# Altium project Board_4.PrjPcb
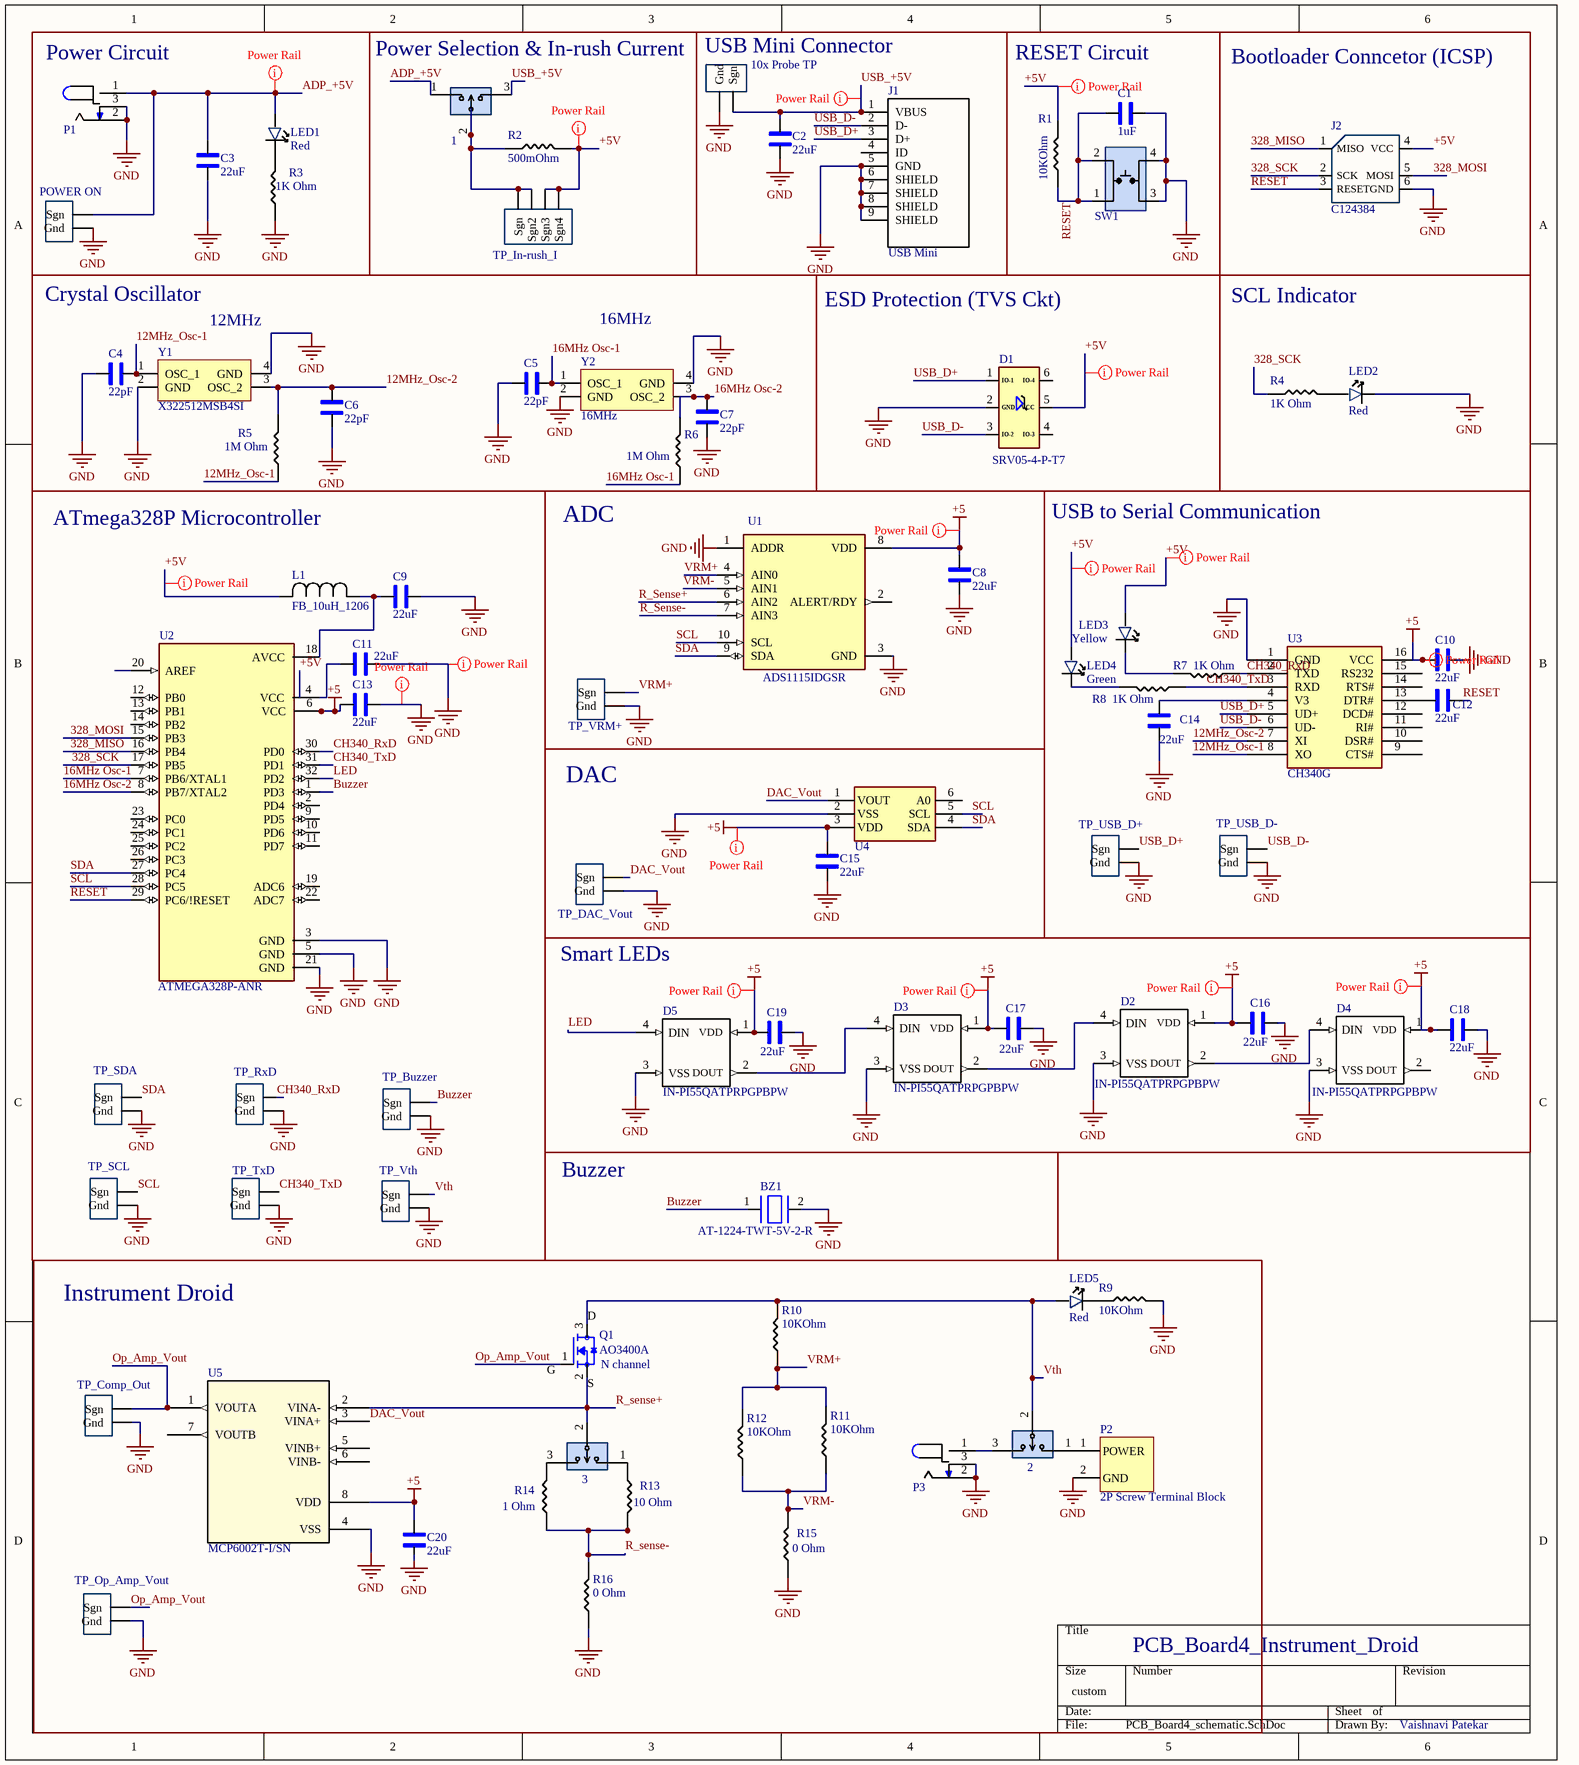
[diagram p0: PCB_Board4_schematic.SchDoc]
1 sheet, 80 parts. Net scope: global (net labels, ports and power ports of the same name join across sheets).
Board file: PCB_Board_4_Layout.PcbDoc

## Sheet PCB_Board4_schematic.SchDoc
size 292 x 330 mm; SheetNumber: 1; SheetTotal: 1

### Parts
1  PREC003SAAN-RC  [3_PIN_100mil]  (value not drawn)
2  PREC003SAAN-RC  [3_PIN_100mil]  (value not drawn)
3  PREC003SAAN-RC  [3_PIN_100mil]  (value not drawn)
BZ1  AT-1224-TWT-5V-2-R  [BUZZER- TH]
C1  1uF  [1206_Passive_Capacitor]
C2  22uF  [1206_Passive_Capacitor]
C3  22uF  [1206_Passive_Capacitor]
C4  22pF  [1206_Passive_Capacitor]
C5  22pF  [1206_Passive_Capacitor]
C6  22pF  [1206_Passive_Capacitor]
C7  22pF  [1206_Passive_Capacitor]
C8  22uF  [1206_Passive_Capacitor]
C9  22uF  [1206_Passive_Capacitor]
C10  22uF  [1206_Passive_Capacitor]
C11  22uF  [1206_Passive_Capacitor]
C12  22uF  [1206_Passive_Capacitor]
C13  22uF  [1206_Passive_Capacitor]
C14  22uF  [1206_Passive_Capacitor]
C15  22uF  [1206_Passive_Capacitor]
C16  22uF  [1206_Passive_Capacitor]
C17  22uF  [1206_Passive_Capacitor]
C18  22uF  [1206_Passive_Capacitor]
C19  22uF  [1206_Passive_Capacitor]
C20  22uF  [1206_Passive_Capacitor]
D1  SRV05-4-P-T7  [TVS]
D2  IN-PI55QATPRPGPBPW  [SERIAL_LED - duplicate]
D3  IN-PI55QATPRPGPBPW  [SERIAL_LED - duplicate]
D4  IN-PI55QATPRPGPBPW  [SERIAL_LED - duplicate]
D5  IN-PI55QATPRPGPBPW  [SERIAL_LED - duplicate]
J1  USB Mini  [USB_MINI_B]
J2  LCSC Part#: C124384  [ICSP]  (hidden comment: NRPN032PAEN-RC)
L1  FB_10uH_1206  [AIML-1206_ABR-M]
LED1  Red  [LED_1206]
LED2  Red  [LED_1206]
LED3  Yellow  [LED_1206]
LED4  Green  [LED_1206]
LED5  Red  [LED_1206]
P1  Power Jack  [Power_Jack]  (value not drawn)
P2  2P Screw Terminal Block  [P_Terminal block 3.5mm-pitch]
P3  Power Jack  [Power_Jack]  (value not drawn)
POWER_ON  10x Probe TP  [TP10x_Probe]  (value not drawn)
Q1  AO3400A  value N channel  [N-MOSFET]
R1  value 10KOhm  [1206_Passive_Resitor]  (hidden comment: 10k)
R2  value 500mOhm  [1206_Passive_Resitor]  (hidden comment: 500m)
R3  value 1K Ohm  [1206_Passive_Resitor]  (hidden comment: 1k)
R4  value 1K Ohm  [1206_Passive_Resitor]  (hidden comment: 1k)
R5  value 1M Ohm  [1206_Passive_Resitor]  (hidden comment: 1M)
R6  value 1M Ohm  [1206_Passive_Resitor]  (hidden comment: 1M)
R7  value 1K Ohm  [1206_Passive_Resitor]  (hidden comment: 1k)
R8  value 1K Ohm  [1206_Passive_Resitor]  (hidden comment: 1k)
R9  value 10KOhm  [1206_Passive_Resitor]  (hidden comment: 10k)
R10  value 10KOhm  [1206_Passive_Resitor]  (hidden comment: 10k)
R11  value 10KOhm  [1206_Passive_Resitor]  (hidden comment: 10k)
R12  value 10KOhm  [1206_Passive_Resitor]  (hidden comment: 10k)
R13  10 Ohm  [1206_Passive_Resitor]
R14  1 Ohm  [1206_Passive_Resitor]
R15  0 Ohm  [1206_Passive_Resitor]
R16  0 Ohm  [1206_Passive_Resitor]
SW1  TL3305AF160QG  [Switch_JLC]  (value not drawn)
TP1  10x Probe TP  [TP10x_Probe]
TP4  TP_VRM+  [TP10x_Probe]
TP5  TP_USB_D+  [TP10x_Probe]
TP6  TP_USB_D-  [TP10x_Probe]
TP7  TP_DAC_Vout  [TP10x_Probe]
TP8  TP_SDA  [TP10x_Probe]
TP9  TP_RxD  [TP10x_Probe]
TP10  TP_Buzzer  [TP10x_Probe]
TP11  TP_SCL  [TP10x_Probe]
TP12  TP_TxD  [TP10x_Probe]
TP13  TP_Vth  [TP10x_Probe]
TP14  TP_Comp_Out  [TP10x_Probe]
TP15  TP_Op_Amp_Vout  [TP10x_Probe]
TP_In-rush_I  TP_In-rush_current  [TP10x_Floating]  (value not drawn)
U1  ADS1115IDGSR  [ADC_ADS1115IDGSR]
U2  ATMEGA328P-ANR  [ATMega328P]
U3  CH340G  [USB to serial]
U4  DAC IC  [MCP4725]  (value not drawn)
U5  MCP6002T-I/SN  [SOIC127P600X175-8N]
Y1  X322512MSB4SI  [Crystal resonator]
Y2  value 16MHz  [Crystal resonator]  (hidden comment: X322516MLB4SI)

### Blocks framed on the sheet
Power Circuit: C3 LED1 P1 POWER_ON R3
Power Selection & In-rush Current: 1 R2 TP_In-rush_I
USB Mini Connector: C2 J1 TP1
RESET Circuit: C1 R1 SW1
Bootloader Conncetor (ICSP): J2
Crystal Oscillator: C4-C7 R5 R6 Y1 Y2
ESD Protection (TVS Ckt): D1
SCL Indicator: LED2 R4
ATmega328P Microcontroller: C9 C11 C13 L1 TP8-TP13 U2
ADC: C8 TP4 U1
USB to Serial Communication: C10 C12 C14 LED3 LED4 R7 R8 TP5 TP6 U3
DAC: C15 TP7 U4
Smart LEDs: C16-C19 D2-D5
Buzzer: BZ1
Instrument Droid: 2 3 C20 LED5 P2 P3 Q1 R9-R16 TP14 TP15 U5

### Nets
+5: C8.1 C10.2 C13.2 C15.1 C16.2 C17.2 C18.1 C19.2 C20.1 D2.1(VDD) D3.1(VDD) D4.1(VDD) D5.1(VDD) U1.8(VDD) U2.6(VCC) U3.16(VCC) U4.3(VDD) U5.8(VDD)
GND: BZ1.2(BZ2) C1.2 C2.1 C3.1 C4.1 C5.1 C6.1 C7.1 C8.2 C9.1 C10.1 C11.1 C13.1 C14.2 C15.2 C16.1 C17.1 C18.2 C19.1 C20.2 D1.2(GND) D2.3(VSS) D3.3(VSS) D4.3(VSS) D5.3(VSS) J1.5(GND) J1.6(SHIELD) J1.7(SHIELD) J1.8(SHIELD) J1.9(SHIELD) J2.6(GND) LED2.2 P1.2 P1.3 P2.2(GND) P3.2 P3.3 POWER_ON.2(Gnd) R3.1 R9.2 R15.1 R16.1 SW1.3 SW1.4 TP1.2(Gnd) TP4.2(Gnd) TP5.2(Gnd) TP6.2(Gnd) TP7.2(Gnd) TP8.2(Gnd) TP9.2(Gnd) TP10.2(Gnd) TP11.2(Gnd) TP12.2(Gnd) TP13.2(Gnd) TP14.2(Gnd) TP15.2(Gnd) U1.1(ADDR) U1.3(GND) U2.3(GND) U2.5(GND) U2.21(GND) U3.1(GND) U4.2(VSS) U5.4(VSS) Y1.2(GND) Y1.4(GND) Y2.2(GND) Y2.4(GND)
12MHz_Osc-1: C4.2 R5.1 U3.8(XO) Y1.1(OSC_1)
12MHz_Osc-2: C6.2 R5.2 U3.7(XI) Y1.3(OSC_2)
16MHz Osc-1: C5.2 R6.1 U2.7(PB6/XTAL1) Y2.1(OSC_1)
16MHz Osc-2: C7.2 R6.2 U2.8(PB7/XTAL2) Y2.3(OSC_2)
328_MISO: J2.1(MISO) U2.16(PB4)
328_MOSI: J2.5(MOSI) U2.15(PB3)
328_SCK: J2.2(SCK) R4.1 U2.17(PB5)
+5V: D1.5(VCC) J2.4(VCC) L1.2 LED3.1 LED4.1 R1.2 R2.2 TP_In-rush_I.3(Sgn3) TP_In-rush_I.4(Sgn4)
ADP_+5V: 1.1 C3.2 LED1.1 P1.1 POWER_ON.1(Sgn)
Buzzer: BZ1.1(BZ1) TP10.1(Sgn) U2.1(PD3)
CH340_RxD: R7.1 TP9.1(Sgn) U2.30(PD0) U3.2(TXD)
CH340_TxD: R8.1 TP12.1(Sgn) U2.31(PD1) U3.3(RXD)
DAC_Vout: TP7.1(Sgn) U4.1(VOUT) U5.3(VINA+)
LED: D5.4(DIN) U2.32(PD2)
Op_Amp_Vout: Q1.1(G) TP14.1(Sgn) TP15.1(Sgn) U5.1(VOUTA)
R_Sense+: 3.2 Q1.2(S) U1.6(AIN2) U5.2(VINA-)
R_Sense-: R13.2 R14.1 R16.2 U1.7(AIN3)
RESET: C1.1 C12.1 J2.3(RESET) R1.1 SW1.1 SW1.2 U2.29(PC6/!RESET)
SCL: TP11.1(Sgn) U1.10(SCL) U2.28(PC5) U4.5(SCL)
SDA: TP8.1(Sgn) U1.9(SDA) U2.27(PC4) U4.4(SDA)
USB_+5V: 1.3 C2.2 J1.1(VBUS) TP1.1(Sgn)
USB_D+: D1.1(IO-1) J1.3(D+) TP5.1(Sgn) U3.5(UD+)
USB_D-: D1.3(IO-2) J1.2(D-) TP6.1(Sgn) U3.6(UD-)
VRM+: R10.1 R11.2 R12.2 TP4.1(Sgn) U1.4(AIN0)
VRM-: R11.1 R12.1 R15.2 U1.5(AIN1)
Vth: 2.2 LED5.1 Q1.3(D) R10.2 TP13.1(Sgn)
Net1_2: 1.2 R2.1 TP_In-rush_I.1(Sgn) TP_In-rush_I.2(Sgn2)
Net2_1: 2.1 P2.1(POWER)
Net2_3: 2.3 P3.1
Net3_1: 3.1 R13.1
Net3_3: 3.3 R14.2
NetC9_2: C9.2 L1.1 U2.18(AVCC)
NetC11_2: C11.2 U2.4(VCC)
NetC12_2: C12.2 U3.13(DTR#)
NetC14_1: C14.1 U3.4(V3)
NetD2_2: D2.2(DOUT) D4.4(DIN)
NetD2_4: D2.4(DIN) D3.2(DOUT)
NetD3_4: D3.4(DIN) D5.2(DOUT)
NetLED1_2: LED1.2 R3.2
NetLED2_1: LED2.1 R4.2
NetLED3_2: LED3.2 R7.2
NetLED4_2: LED4.2 R8.2
NetLED5_2: LED5.2 R9.1

Not connected (* = marked no-connect by the designer): D1 4(IO-3) 6(IO-4); D4 2(DOUT); J1 4(ID); U1 2(ALERT/RDY); U2 2(PD4) 9(PD5) 10(PD6) 11(PD7) 12(PB0) 13(PB1) 14(PB2) 19(ADC6) 20(AREF) 22(ADC7) 23(PC0) 24(PC1) 25(PC2) 26(PC3); U3 9(CTS#) 10(DSR#) 11(RI#) 12(DCD#) 14(RTS#) 15(RS232); U4 6(A0); U5 5(VINB+) 6(VINB-) 7(VOUTB)

### Layout directives
mark named Power Rail: +5V
rule Width Constraint [Pref Width = 20mil    Min Width = 20mil    Max Width = 100mil]: +5, +5V, ADP_+5V, GND, USB_+5V

### Notes on the sheet
- (near Y1) 12MHz
- 16MHz
- PCB_Board4_Instrument_Droid
- Vaishnavi Patekar

### Library data of the parts
1-3 = SW_3Pin_100mil_Switch: Connector Header Through Hole 3 position 0.100" (2.54mm); Value: CONN HEADER VERT 3POS 2.54MM; Digikey Link: https://www.digikey.com/product-detail/en/PREC003SAAN-RC/S1012EC-03-ND/2774851/?itemSeq=304982371; MFR Part #: PREC003SAAN-RC; Type: Extended; LCSC Part#: C49257
BZ1 = BUZZER_1: Buzzers Transducer, Externally Driven Electromechanical/Magnetic 5 V 40mA 2.4kHz 87dB @ 5V, 10cm Through Hole PC Pins; Datasheet: https://www.puiaudio.com/media/SpecSheet/AT-1224-TWT-5V-2-R.pdf; MFR Part #: AT-1224-TWT-5V-2-R
C1 = C_1uF_1206: MULTILAYER CERAMIC CAPACITORS MLCC - SMD/SMT 1UF 50V 1206 ROHS; MFR Part #: CL31B105KBHNNNE; Type: Basic; Digikey Link: https://www.digikey.com/product-detail/en/C1206C105M4RACTU/399-8150-1-ND/3471873/?itemSeq=304982366; LCSC Part#: C1848; Value: 1uF
C2 C3 C8-C20 = C_22uF_1206: 22uF ±10% 25V X5R 1206 Multilayer Ceramic Capacitors MLCC - SMD/SMT RoHS; MFR Part #: CL31A226KAHNNNE; Type: basic; LCSC Part#: C12891; Datasheet: https://datasheet.lcsc.com/lcsc/1811031514_Samsung-Electro-Mechanics-CL31A226KAHNNNE_C12891.pdf; Value: 22uF
C4-C7 = C_22pF_1206: 22pF ±5% 1kV C0G 1206 Multilayer Ceramic Capacitors MLCC - SMD/SMT RoHS; MFR Part #: 1206CG220J102NT; Type: Extended; LCSC Part#: C313096; Datasheet: https://datasheet.lcsc.com/lcsc/1810311150_FH-Guangdong-Fenghua-Advanced-Tech-1206CG220J102NT_C313096.pdf; Value: 22pF
D1 = D_TVS_Diode: TVS SOT-23-6 ROHS; Value: TVS DIODE 5.5V 6TSOP; Type: Basic; MFR Part #: SRV05-4-P-T7; LCSC Part#: C85364; Datasheet: https://datasheet.lcsc.com/szlcsc/ProTek-Devices-SRV05-4-P-T7_C85364.pdf
D2-D5 = LED_Smart: LIGHT EMITTING DIODES (LED) RGB 620~630NM RED, 520~530NM GREEN, 465~475NM BLUE 600MCD@16MARED,1200MCD@16MAGREEN,300MCD@16MABLUE TOP VIEW SMD-4 ROHS; MFR Part #: IN-PI55QATPRPGPBPW-60; Manufacturer: Inolux; LCSC Part#: C2761795; DataSheet: https://datasheet.lcsc.com/lcsc/2106062036_Worldsemi-WS2812B-B-W_C2761795.pdf
J1 = J_USB_B_Mini: Through Hole USB Connectors RoHS; MFR Part #: 920-462A2021D10102; Value: USB mini B; LCSC Part#: C46398; Datasheet: https://datasheet.lcsc.com/szlcsc/2103081233_Jing-Extension-of-the-Electronic-Co-920-462A2021D10102_C46398.pdf; Type: Extended
J2 = J_ICSP: Connector Header Through Hole 6 position 0.079" (2.00mm); Digikey Link: https://www.digikey.com/product-detail/en/NRPN032PAEN-RC/S5801-03-ND/804955/?itemSeq=304982355; MFR Part #: NRPN032PAEN-RC; Type: Extended
L1 = FB_10uH_1206: 25mA 10uH ±10% 800mΩ 1206  Inductors (SMD) ROHS; Mfr_Name: FH (Guangdong Fenghua Advanced Tech); MFR PART #: CMI321609X100KT; Type: Basic; LCSC PART#: C1051; DataSheet: https://datasheet.lcsc.com/lcsc/1810311314_FH--Guangdong-Fenghua-Advanced-Tech-CMI321609X100KT_C1051.pdf
LED1 LED2 LED5 = LED_RED_1206: Red 621~631nm 1206 Light Emitting Diodes (LED) RoHS; MFR Part #: 15-21/R6C-FQ1R1B/2T; Type: Extended; LCSC Part#: C93133; Datasheet: https://datasheet.lcsc.com/szlcsc/1811151241_Everlight-Elec-15-21-R6C-FQ1R1B-2T_C93133.pdf; Value: Red
LED3 = LED_YELLOW_1206: yellow 1206  Light Emitting Diodes (LED) ROHS; MFR Part #: NCD1206Y1; Type: Extended; LCSC Part#: C93094; Datasheet: https://datasheet.lcsc.com/lcsc/2008201033_Foshan-NationStar-Optoelectronics-NCD1206Y1_C93094.pdf; Value: Yellow
LED4 = LED_GREEN_1206: Green 513~528nm 1206 Light Emitting Diodes (LED) RoHS; MFR Part #: SZYY1206G; Type: Extended; LCSC Part#: C434439; Datasheet: https://datasheet.lcsc.com/lcsc/2006301532_Yongyu-Photoelectric-SZYY1206G_C434439.pdf; Value: Green
P1 P3 = P_Power Jack: Power Barrel Connector Jack 2.10mm ID (0.083"), 5.50mm OD (0.217") Through Hole, Right Angle; MFR Part #: PJ-102A; Value: CONN PWR JACK 2X5.5MM SOLDER; Digikey Link: https://www.digikey.com/product-detail/en/PJ-102A/CP-102A-ND/275425/?itemSeq=304982367; LCSC Part#: C136744; Type: Extended
P2 = P_Terminal block: Green Straight pin 3.5mm  pitch; P=3.5mm  Screw terminal ROHS; MFR Part #: KF350-3.5-2P; Manufacturer: Cixi Kefa Elec; LCSC Part#: C474892; DataSheet: https://datasheet.lcsc.com/lcsc/2001160007_Cixi-Kefa-Elec-KF350-3-5-2P_C474892.pdf
POWER_ON TP1 TP4-TP15 = TP_10x_Probe: Test Point 300 mil centers
Q1 = Q_Nch_MOSFET: MOSFET N Trench 30V 5.7A 1.5V @ 250uA 26.5 m? @ 5.7A,10V SOT-23-3L RoHS; Type: Basic; LCSC Part#: C20917; Datasheet: https://datasheet.lcsc.com/szlcsc/Alpha-Omega-Semicon-AOS-AO3400A_C20917.pdf; MFR Part #: AO3400A
R1 R9-R12 = R_10KOhm_1206: 10 kOhms ±5% 0.25W, 1/4W Chip Resistor 1206 (3216 Metric) Automotive AEC-Q200 Thick Film; MFR Part #: RMCF1206FT10K0; Digikey Link: https://www.digikey.com/en/products/detail/stackpole-electronics-inc/RMCF1206FT10K0/1759669; LCSC Part#: C17902; Type: Basic
R2 = R_500mOhm_1206: Resistors/Shunt 250mW 500mΩ ±800ppm/℃ ±5% 1206  Current Sense  Resistors ROHS; MFR Part #: 1206W4J050KT5E; Datasheet: https://datasheet.lcsc.com/lcsc/1810301438_UNI-ROYAL-Uniroyal-Elec-1206W4J050KT5E_C247433.pdf; LCSC Part#: C247433; Type: Extended
R3 R4 R7 R8 = R_1K_1206: CHIP RESISTOR - SURFACE MOUNT 1KOHMS ±1% 1/4W 1206 ROHS; MFR Part #: RNCP1206FTD1K00CT; Digikey Link: https://www.digikey.com/product-detail/en/RNCP1206FTD1K00/RNCP1206FTD1K00CT-ND/2240675/?itemSeq=304982373; LCSC Part#: C4410; Type: Basic
R5 R6 = R_1M_1206: CHIP RESISTOR - SURFACE MOUNT 1MOHMS ±1% 1/4W 1206 ROHS; MFR Part #: RMCF1206JT1M00; Digikey Link: https://www.digikey.com/product-detail/en/RMCF1206JT1M00/RMCF1206JT1M00CT-ND/1942830/?itemSeq=304982358; LCSC Part#: C17927; Type: Basic
R13 = R_10Ohm_1206: CHIP RESISTOR - SURFACE MOUNT 0.1OHMS ±1% 1/4W 1206 ROHS; MFR Part #: 1206W4F100JT5E; Datasheet: https://datasheet.lcsc.com/szlcsc/Uniroyal-Elec-1206W4F100JT5E_C17903.pdf; LCSC Part#: C17903; Type: Basic; Value: 10 Ohm
R14 = R_1Ohm_1206: 1Ω ±5% 0.25W ±400ppm/℃ 1206 Chip Resistor - Surface Mount RoHS; MFR Part #: 1206W4J010JT5E; LCSC Part#: C1409; Datasheet: https://datasheet.lcsc.com/lcsc/1810301410_UNI-ROYAL-Uniroyal-Elec-1206W4J010JT5E_C1409.pdf; Type: Extended; Value: 1 Ohm
R15 R16 = R_0Ohm_1206: CHIP RESISTOR - SURFACE MOUNT 0OHMS ±1% 1/4W 1206 ROHS; MFR Part #: 1206W4F0000T5E; Datasheet: https://datasheet.lcsc.com/szlcsc/Uniroyal-Elec-1206W4F0000T5E_C17888.pdf; LCSC Part#: C17888; Type: Basic; Mouser link: https://www.mouser.com/ProductDetail/Royalohm/1206W4F0000T5E?qs=e8oIoAS2J1Thbopin%252BsagQ%3D%3D; Value: 0 Ohm
SW1 = SW_Push_Button_JLC: Tactile Switch SPST-NO Top Actuated Surface Mount; MFR Part #: KH-4.5X4.5X4.3H-STM; LCSC Part#: C2837550; Type: Extended; DataSheet: https://datasheet.lcsc.com/lcsc/2106081532_Shenzhen-Kinghelm-Elec-KH-4.5X4.5X4.3H-STM_C2837550.pdf
TP_In-rush_I = TP_10x_Floating: Test Point 300 mil centers
U1 = U_ADC_ADS1115IDGSR: 16-Bit ADC with Integrated MUX, PGA, Comparator, Oscillator, and Reference 10-VSSOP -40 to 125; MFR Part #: ADS1115IDGSR; Package: MSOP-10 Texas Instruments; LCSC Part#: C37593; SnapEDA_Link: https://www.snapeda.com/parts/ADS1115IDGSR/Texas%20Instruments/view-part/?ref=snap; Type: Extended; DigiKey link: https://www.digikey.com/product-detail/en/texas-instruments/ADS1115IDGSR/296-38849-1-ND/5142969?utm_source=snapeda&utm_medium=aggregator&utm_campaign=symbol; Value: *
U2 = U_ATMega328P: AVR AVR® ATmega Microcontroller IC 8-Bit 20MHz 32KB (16K x 16) FLASH 32-TQFP (7x7); MFR Part #: ATMEGA328P-AU; Value: IC MCU 8BIT 32KB FLASH 32TQFP; Digikey Link: https://www.digikey.com/product-detail/en/ATMEGA328P-ANR/ATMEGA328P-ANRCT-ND/2774230/?itemSeq=304982365; LCSC Part#: C14877; Type: Basic
U3 = U_USBtoSerial: Transceiver USB 2.0 2Mbps SOP-16_150mil USB ICs RoHS; Datasheet: https://datasheet.lcsc.com/lcsc/2008191806_WCH-Jiangsu-Qin-Heng-CH340G_C14267.pdf; LCSC Part#: C14267; MFR Part #: CH340G; Type: Basic; Value: USB to Serial
U4 = U_MCP4725A0T-E/CH: IC DAC 12BIT V-OUT SOT23-6; Datasheet: https://ww1.microchip.com/downloads/en/DeviceDoc/22039d.pdf; LCSC Part#: C144198; type: Extended; MFR Part #: MCP4725A0T-E/CH
U5 = U_MCP6002T-I/SN: 0.6 V/us 2 1MHz 1.8V ~ 6V 100μA General Purpose SOIC-8_150mil  Operational Amplifier ROHS; Mfr: Microchip; MFR Part #: MCP6002T-I/SN; DataSheet: https://ww1.microchip.com/downloads/en/DeviceDoc/MCP6001-1R-1U-2-4-1-MHz-Low-Power-Op-Amp-DS20001733L.pdf; LCSC Part#: C7377; Type: Basic
Y1 = X_12MHz_Res: SMD Crystal Resonators 12MHz ±10ppm SMD-3225_4P RoHS; LCSC Part#: C9002; MFR Part #: X322512MSB4SI; Value: 12MHz; Type: Basic; Datasheet: https://datasheet.lcsc.com/szlcsc/Yangxing-Tech-X322512MSB4SI_C9002.pdf
Y2 = X_16Mhz_Res: ±10ppm 16000000Hz -40℃~85℃ 贴片无源晶振 60Ω 9pF SMD3225-4P Crystals ROHS; LCSC Part#: C13738; MFR Part #: X322516MLB4SI; Type: Basic